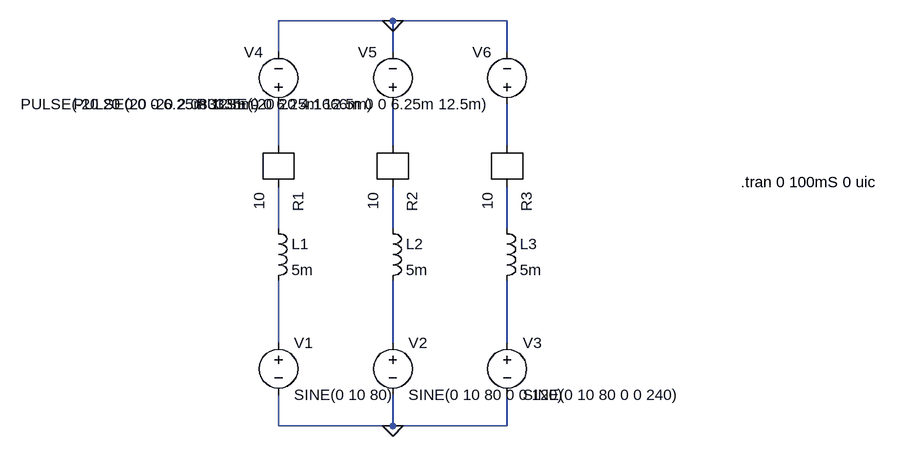
[diagram p0: schematic motor2.asc]
motor2.asc, the LTspice schematic file:
Version 4
SHEET 1 1300 680
WIRE 544 -208 368 -208
WIRE 720 -208 544 -208
WIRE 368 -160 368 -208
WIRE 544 -160 544 -208
WIRE 720 -160 720 -208
WIRE 368 -16 368 -80
WIRE 544 -16 544 -80
WIRE 720 -16 720 -80
WIRE 368 112 368 48
WIRE 544 112 544 48
WIRE 720 112 720 48
WIRE 368 288 368 192
WIRE 544 288 544 192
WIRE 720 288 720 192
WIRE 368 416 368 368
WIRE 544 416 544 368
WIRE 544 416 368 416
WIRE 720 416 720 368
WIRE 720 416 544 416
FLAG 544 416 0
FLAG 544 -208 0
SYMBOL voltage 368 272 R0
SYMATTR InstName V1
SYMATTR Value SINE(0 10 80)
SYMBOL voltage 544 272 R0
SYMATTR InstName V2
SYMATTR Value SINE(0 10 80 0 0 120)
SYMBOL voltage 720 272 R0
SYMATTR InstName V3
SYMATTR Value SINE(0 10 80 0 0 240)
SYMBOL voltage 368 -64 R180
WINDOW 0 24 96 Left 2
WINDOW 3 24 16 Left 2
SYMATTR InstName V4
SYMATTR Value PULSE(-20 20 0 0 0 6.25m 12.5m)
SYMBOL r 368 -16 R90
SYMATTR InstName R1
SYMATTR Value 10
SYMBOL r 544 -16 R90
SYMATTR InstName R2
SYMATTR Value 10
SYMBOL r 720 -16 R90
SYMATTR InstName R3
SYMATTR Value 10
SYMBOL ind 352 96 R0
SYMATTR InstName L1
SYMATTR Value 5m
SYMBOL ind 528 96 R0
SYMATTR InstName L2
SYMATTR Value 5m
SYMBOL ind 704 96 R0
SYMATTR InstName L3
SYMATTR Value 5m
SYMBOL voltage 544 -64 R180
WINDOW 0 24 96 Left 2
WINDOW 3 24 16 Left 2
SYMATTR InstName V5
SYMATTR Value PULSE(20 -20 2.08333m 0 0 6.25m 12.5m)
SYMBOL voltage 720 -64 R180
WINDOW 0 24 96 Left 2
WINDOW 3 24 16 Left 2
SYMATTR InstName V6
SYMATTR Value PULSE(-20 20 4.1666m 0 0 6.25m 12.5m)
TEXT 1080 40 Left 2 !.tran 0 100mS 0 uic

The netlist it stands for:
* motor2.asc
V1 N007 0 SINE(0 10 80)
V2 N008 0 SINE(0 10 80 0 0 120)
V3 N009 0 SINE(0 10 80 0 0 240)
V4 N001 0 PULSE(-20 20 0 0 0 6.25m 12.5m)
R1 N004 N001 10
R2 N005 N002 10
R3 N006 N003 10
L1 N004 N007 5m
L2 N005 N008 5m
L3 N006 N009 5m
V5 N002 0 PULSE(20 -20 2.08333m 0 0 6.25m 12.5m)
V6 N003 0 PULSE(-20 20 4.1666m 0 0 6.25m 12.5m)
.tran 0 100mS 0 uic
.backanno
.end